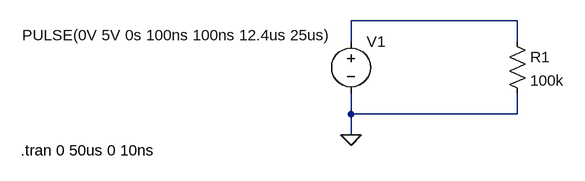
[diagram p0: schematic 40kHz square wave.asc]
40kHz square wave.asc, the LTspice schematic file:
Version 4
SHEET 1 880 680
WIRE 192 -288 -64 -288
WIRE -64 -256 -64 -288
WIRE 192 -256 192 -288
WIRE -64 -144 -64 -176
WIRE 192 -144 192 -176
WIRE 192 -144 -64 -144
WIRE -64 -112 -64 -144
FLAG -64 -112 0
SYMBOL res 176 -272 R0
SYMATTR InstName R1
SYMATTR Value 100k
SYMBOL voltage -64 -272 R0
WINDOW 3 -506 6 Left 2
WINDOW 123 0 0 Left 2
WINDOW 39 0 0 Left 2
SYMATTR InstName V1
SYMATTR Value PULSE(0V 5V 0s 100ns 100ns 12.4us 25us)
TEXT -572 -88 Left 2 !.tran 0 50us 0 10ns

The netlist it stands for:
* 40kHz square wave.asc
R1 N001 0 100k
V1 N001 0 PULSE(0V 5V 0s 100ns 100ns 12.4us 25us)
.tran 0 50us 0 10ns
.backanno
.end